# EAGLE design HW4 (EAGLE 9.6.2)
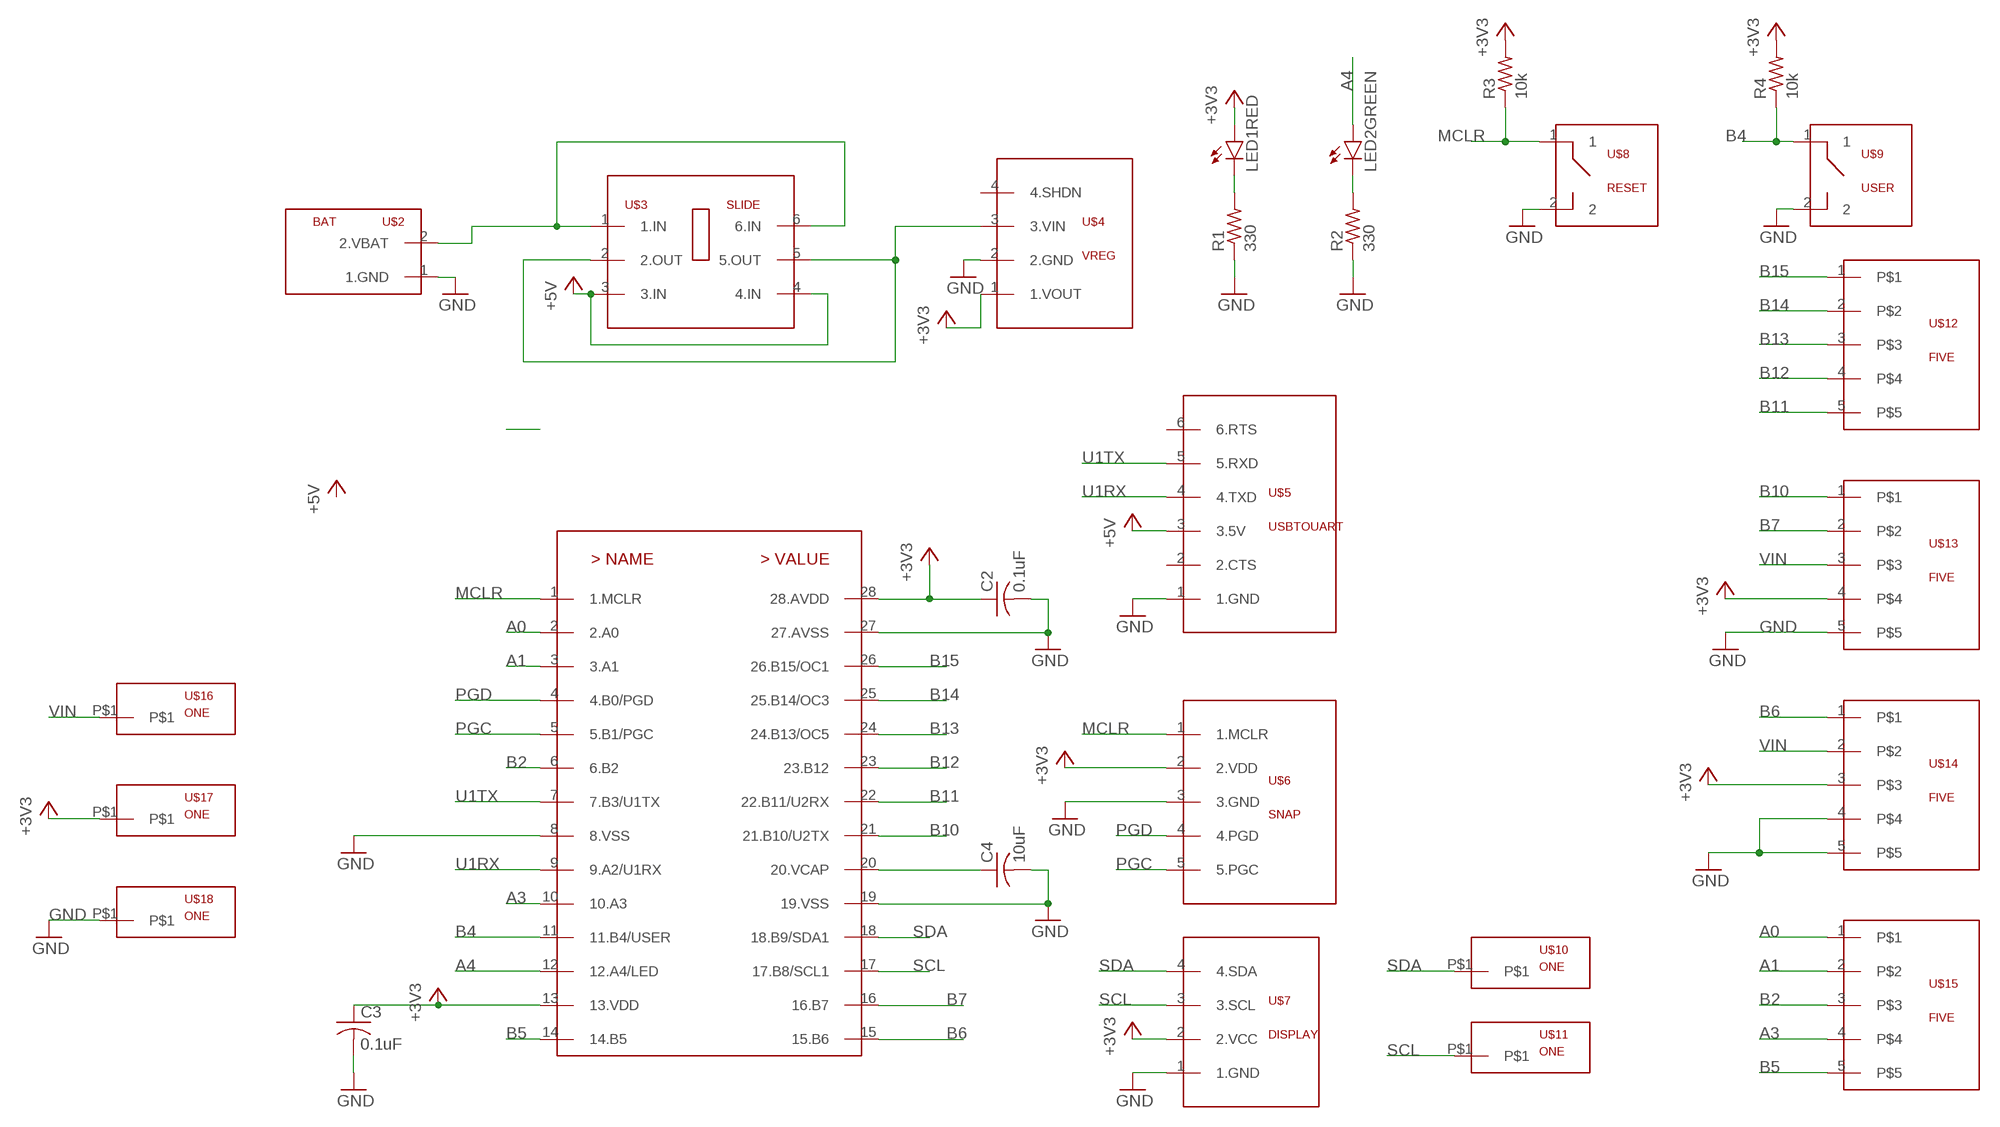
[diagram p0: schematic, sheet 1]

## Parts
C2  0.1uF  C-US025-024X044  [C025-024X044]
C3  0.1uF  C-US025-024X044  [C025-024X044]
C4  10uF  C-US025-024X044  [C025-024X044]
LED1RED  LED3MM  [LED3MM]
LED2GREEN  LED3MM  [LED3MM]
R1  330  R-US_0207/7  [0207/7]
R2  330  R-US_0207/7  [0207/7]
R3  10k  R-US_0207/7  [0207/7]
R4  10k  R-US_0207/7  [0207/7]
U$1  PIC32  [DIL28-3]
U$2  BAT  [BAT]
U$3  SLIDE  [SLIDE]
U$4  VREG  [VREG]
U$5  USBTOUART  [USBTOUART]
U$6  SNAP  [SNAP]
U$7  DISPLAY  [DISPLAY]
U$8  RESET  BUTTON  [BUTTON]
U$9  USER  BUTTON  [BUTTON]
U$10  ONE  [ONE]
U$11  ONE  [ONE]
U$12  FIVE  [FIVE]
U$13  FIVE  [FIVE]
U$14  FIVE  [FIVE]
U$15  FIVE  [FIVE]
U$16  ONE  [ONE]
U$17  ONE  [ONE]
U$18  ONE  [ONE]

## Nets
+3V3: C2.1 C3.1 LED1RED.A R3.2 R4.2 U$1.13(13.VDD) U$1.28(28.AVDD) U$4.1(1.VOUT) U$6.2(2.VDD) U$7.2(2.VCC) U$13.4 U$14.3 U$17.P$1
+5V: U$3.3(3.IN) U$3.4(4.IN) U$5.3(3.5V)
A0: U$1.2(2.A0) U$15.1
A1: U$1.3(3.A1) U$15.2
A3: U$1.10(10.A3) U$15.4
A4: LED2GREEN.A U$1.12(12.A4/LED)
B2: U$1.6(6.B2) U$15.3
B4: R4.1 U$1.11(11.B4/USER) U$9.1
B5: U$1.14(14.B5) U$15.5
B6: U$1.15(15.B6) U$14.1
B7: U$1.16(16.B7) U$13.2
B10: U$1.21(21.B10/U2TX) U$13.1
B11: U$1.22(22.B11/U2RX) U$12.5
B12: U$1.23(23.B12) U$12.4
B13: U$1.24(24.B13/OC5) U$12.3
B14: U$1.25(25.B14/OC3) U$12.2
B15: U$1.26(26.B15/OC1) U$12.1
GND: C2.2 C3.2 C4.2 R1.1 R2.1 U$1.8(8.VSS) U$1.19(19.VSS) U$1.27(27.AVSS) U$2.1(1.GND) U$4.2(2.GND) U$5.1(1.GND) U$6.3(3.GND) U$7.1(1.GND) U$8.2 U$9.2 U$13.5 U$14.4 U$14.5 U$18.P$1
MCLR: R3.1 U$1.1(1.MCLR) U$6.1(1.MCLR) U$8.1
N$1: LED1RED.K(C) R1.2
N$2: LED2GREEN.K(C) R2.2
N$3: U$2.2(2.VBAT) U$3.1(1.IN) U$3.6(6.IN)
N$4: U$3.2(2.OUT) U$3.5(5.OUT) U$4.3(3.VIN)
N$17: C4.1 U$1.20(20.VCAP)
PGC: U$1.5(5.B1/PGC) U$6.5(5.PGC)
PGD: U$1.4(4.B0/PGD) U$6.4(4.PGD)
SCL: U$1.17(17.B8/SCL1) U$7.3(3.SCL) U$11.P$1
SDA: U$1.18(18.B9/SDA1) U$7.4(4.SDA) U$10.P$1
U1RX: U$1.9(9.A2/U1RX) U$5.4(4.TXD)
U1TX: U$1.7(7.B3/U1TX) U$5.5(5.RXD)
VIN: U$13.3 U$14.2 U$16.P$1
Unconnected: U$4.4(4.SHDN) U$5.2(2.CTS) U$5.6(6.RTS)

## Library data of the parts
C2-C4 = hw4:C-US: CAPACITOR, American symbol; SPICEPREFIX: C
LED1RED LED2GREEN = hw4:LED: LED OSRAM: - CHIPLED LG R971, LG N971, LY N971, LG Q971, LY Q971, LO R971, LY R971 LH N974, LH R974 LS Q976, LO Q976, LY Q976 LO Q996 - Hyper CHIPLED LW Q18S LB Q993, LB Q99A, LB R99A - SideLED LS A670, LO A670, LY A670, LG A670, LP A670 LB A673, LV A673, LT A673, LW A673 LH A674 LY A675 LS A676, LA A676, LO A676, LY A676, LW A676 LS A679, LY A679, LG A679 - Hyper Micro SIDELED® LS Y876, LA Y876, LO Y876, LY Y876 LT Y87S - SmartLED LW L88C, LW L88S LB L89C, LB L89S, LG L890 LS L89K, LO L89K, LY L89K LS L896, LA L896, LO L896, LY L896 - TOPLED LS T670, LO T670, LY T670, LG T670, LP T670 LSG T670, LSP T670, LSY T670, LOP T670, LYG T670 LG T671, LOG T671, LSG T671 LB T673, LV T673, LT T673, LW T673 LH T674 LS T676, LA T676, LO T676, LY T676, LB T676, LH T676, LSB T676, LW T676 LB T67C, LV T67C, LT T67C, LS T67K, LO T67K, LY T67K, LW E67C LS E67B, LA E67B, LO E67B, LY E67B, LB E67C, LV E67C, LT E67C LW T67C LS T679, LY T679, LG T679 LS T770, LO T770, LY T770, LG T770, LP T770 LB T773, LV T773, LT T773, LW T773 LH T774 LS E675, LA E675, LY E675, LS T675 LS T776, LA T776, LO T776, LY T776, LB T776 LHGB T686 LT T68C, LB T68C - Hyper Mini TOPLED® LB M676 - Mini TOPLED Santana® LG M470 LS M47K, LO M47K, LY M47K Source: http://www.osram.convergy.de LUXEON: - LUMILED® LXK2-PW12-R00, LXK2-PW12-S00, LXK2-PW14-U00, LXK2-PW14-V00 LXK2-PM12-R00, LXK2-PM12-S00, LXK2-PM14-U00 LXK2-PE12-Q00, LXK2-PE12-R00, LXK2-PE12-S00, LXK2-PE14-T00, LXK2-PE14-U00 LXK2-PB12-K00, LXK2-PB12-L00, LXK2-PB12-M00, LXK2-PB14-N00, LXK2-PB14-P00, LXK2-PB14-Q00 LXK2-PR12-L00, LXK2-PR12-M00, LXK2-PR14-Q00, LXK2-PR14-R00 LXK2-PD12-Q00, LXK2-PD12-R00, LXK2-PD12-S00 LXK2-PH12-R00, LXK2-PH12-S00 LXK2-PL12-P00, LXK2-PL12-Q00, LXK2-PL12-R00 Source: www.luxeon.com KINGBRIGHT: KA-3528ASYC Source: www.kingbright.com
R1-R4 = hw4:R-US_: RESISTOR, American symbol; SPICEPREFIX: R
U$1 = hw4:PIC32
U$2 = hw4:BAT
U$3 = hw4:SLIDE
U$4 = hw4:VREG
U$5 = hw4:USBTOUART
U$6 = hw4:SNAP
U$7 = hw4:DISPLAY
U$8 U$9 = hw4:BUTTON
U$10 U$11 U$16-U$18 = hw4:ONE
U$12-U$15 = hw4:FIVE

## Board
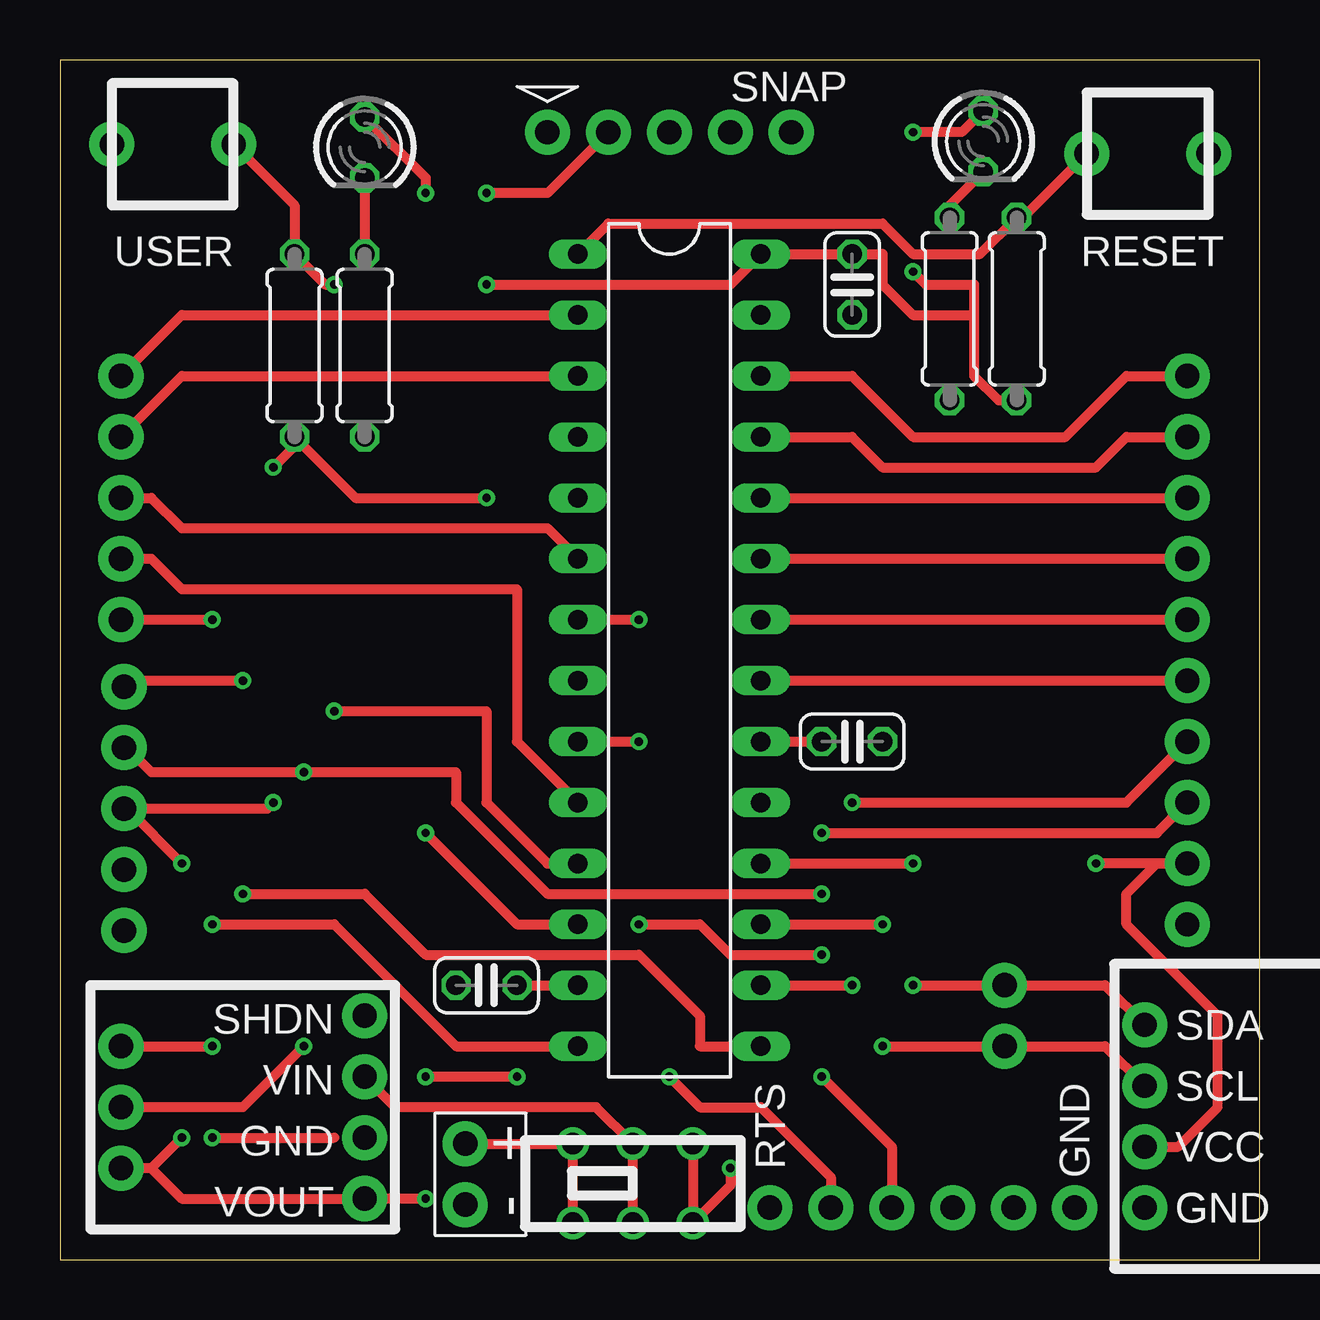
[diagram p1: board, top side]
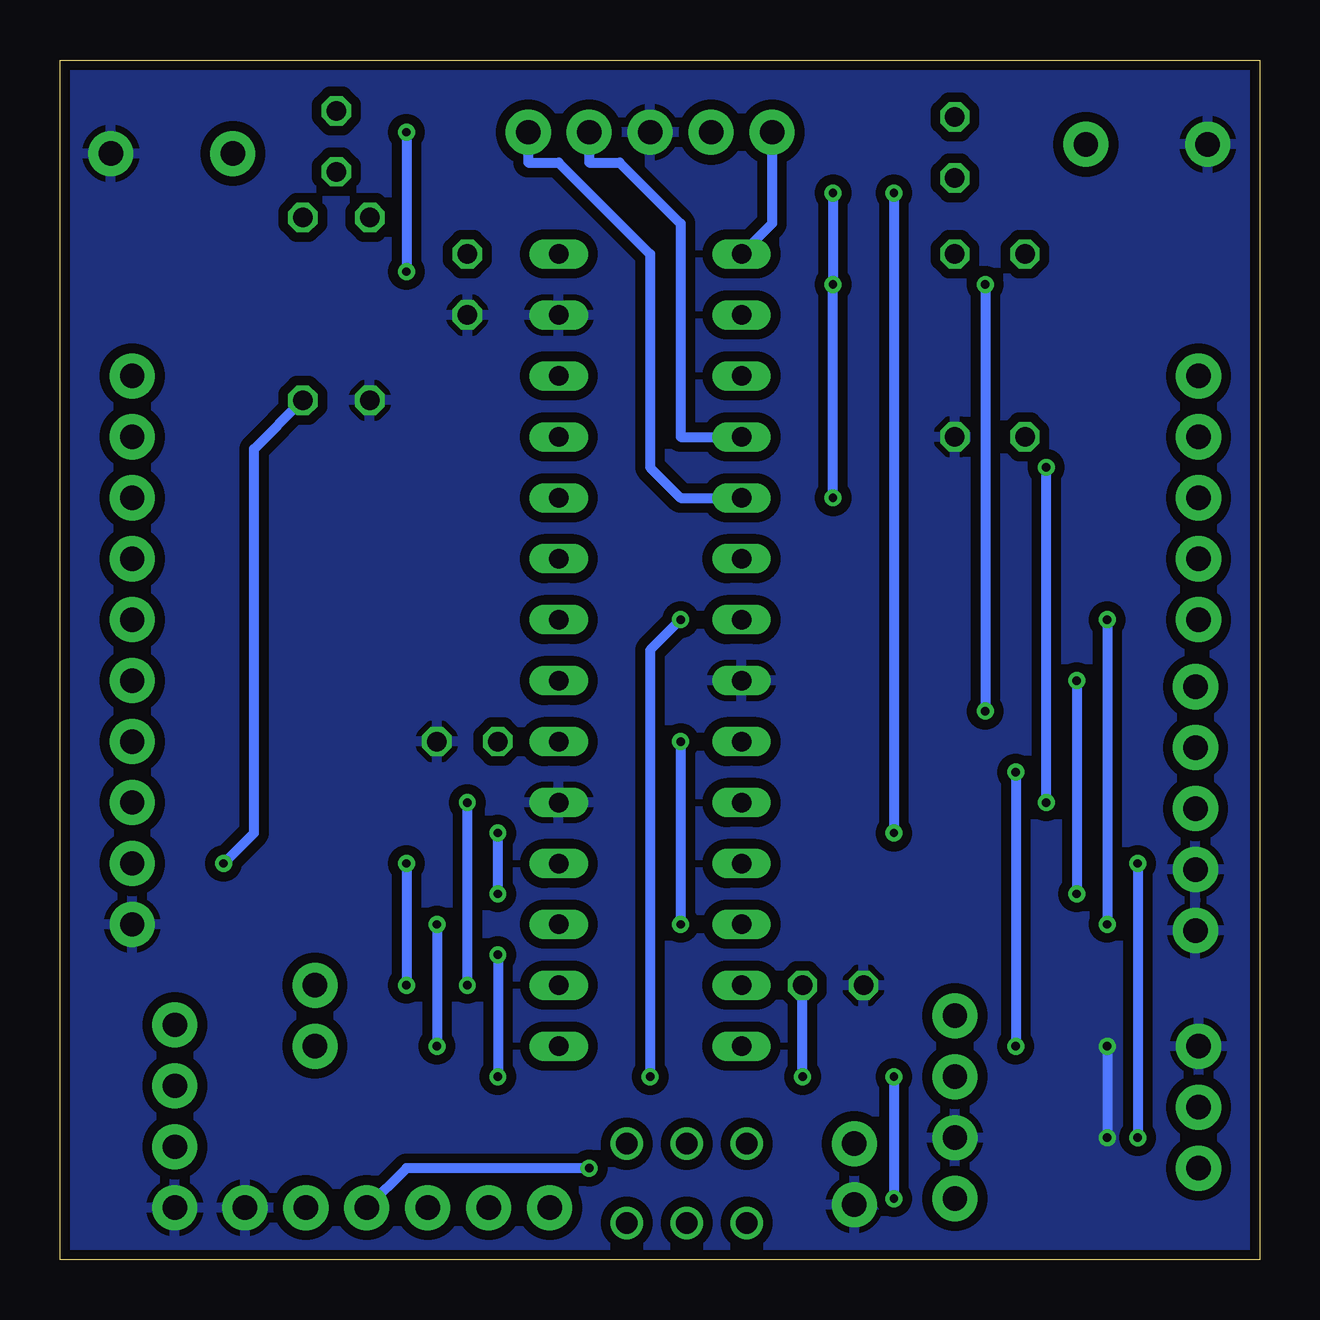
[diagram p2: board, bottom side, seen from below]

Size 50 x 50 mm. Coordinates in mm from the lower left corner, seen from the top.
Outline: 0,0 50,0 50,50 0,50 0,0
Copper layers (1*16): Top 0.035mm / dielectric 1.5mm / Bottom 0.035mm
Design rules "SparkFun-2-Layer-General-JLCPCB": minimum track width 7mil, minimum drill 0.3mm, track to track 7mil, track to pad 7mil, pad to pad 7mil, via to via 7mil, smd to smd 7mil, copper to edge 7mil, drill to drill 7mil, minimum pad ring 7mil, minimum via ring 7mil, stop-mask expansion 3mil, vias tented up to drill 25mil, thermal gap 10mil

### Footprints (pad centres in the part's own frame; a part is rotated, then mirrored left to right if it is on the bottom)
C025-024X044 = drill 0.813 octagon: 1 -1.27,0; 2 1.27,0
LED3MM = drill 0.813 octagon: A -1.27,0; K 1.27,0
0207/7 = drill 0.813 octagon: 1 -3.81,0; 2 3.81,0
DIL28-3 = drill 0.813 long: 1 -16.51,-3.81; 2 -13.97,-3.81; 3 -11.43,-3.81; 4 -8.89,-3.81; 5 -6.35,-3.81; 6 -3.81,-3.81; 7 -1.27,-3.81; 8 1.27,-3.81; 9 3.81,-3.81; 10 6.35,-3.81; 11 8.89,-3.81; 12 11.43,-3.81; 13 13.97,-3.81; 14 16.51,-3.81; 15 16.51,3.81; 16 13.97,3.81; 17 11.43,3.81; 18 8.89,3.81; 19 6.35,3.81; 20 3.81,3.81; 21 1.27,3.81; 22 -1.27,3.81; 23 -3.81,3.81; 24 -6.35,3.81; 25 -8.89,3.81; 26 -11.43,3.81; 27 -13.97,3.81; 28 -16.51,3.81
BAT = drill 1.016 pad 1.88: 1 -1.27,0; 2 1.27,0
SLIDE = drill 0.9: 1 -2.5,-1.65; 2 0,-1.65; 3 2.5,-1.65; 4 2.5,1.65; 5 0,1.65; 6 -2.5,1.65
VREG = drill 1.016 pad 1.88: 1 -3.81,0; 2 -1.27,0; 3 1.27,0; 4 3.81,0
USBTOUART = drill 1.016 pad 1.88: 1 -6.35,0; 2 -3.81,0; 3 -1.27,0; 4 1.27,0; 5 3.81,0; 6 6.35,0
SNAP = drill 1.016 pad 1.88: 1 -5.08,0; 2 -2.54,0; 3 0,0; 4 2.54,0; 5 5.08,0
DISPLAY = drill 1.016 pad 1.88: 1 -5.08,-3.81; 2 -5.08,-1.27; 3 -5.08,1.27; 4 -5.08,3.81
BUTTON = drill 1.016 pad 1.88: 1 -2.54,0; 2 2.54,0
ONE = drill 1.016 pad 1.88: P$1 0,0
FIVE = drill 1.016 pad 1.88: 1 -5.08,0; 2 -2.54,0; 3 0,0; 4 2.54,0; 5 5.08,0

### Placement (x,y rotation side)
C2  33.02,40.64 270 top
C3  17.78,11.43 180 top
C4  33.02,21.59 0 top
LED1RED  38.48,46.61 270 top
LED2GREEN  12.7,46.35 270 top
R1  37.08,39.62 90 top
R2  12.7,38.1 90 top
R3  39.88,39.62 270 top
R4  9.78,38.1 270 top
U$1  25.4,25.4 270 top
U$2  16.89,3.56 90 top
U$3  23.88,3.17 0 top
U$4  12.7,6.35 90 top
U$5  35.94,2.16 180 top
U$6  25.4,46.99 0 top
U$7  50.29,5.97 0 top
U$8  45.34,46.1 0 top
U$9  4.7,46.48 180 top
U$10  39.37,11.43 0 top
U$11  39.37,8.89 0 top
U$12  46.99,31.75 270 top
U$13  46.99,19.05 270 top
U$14  2.67,18.8 270 top
U$15  2.54,31.75 270 top
U$16  2.54,6.35 0 top
U$17  2.54,3.81 0 top
U$18  2.54,8.89 0 top

### Tracks (layer width: path | path; a pad name or v marks a point on that pad's centre or on a via)
+3V3  (via drill 0.35)
  Top 0.406: C3.1 U$1.13 | U$7.2 46.61,4.7 48.26,6.35 48.26,10.16 44.45,13.97 44.45,15.24 45.72,16.51 U$13.4 v43.18,16.51 | 3.81,3.81 5.08,2.54 U$4.1 v15.24,2.54 | v17.78,31.75 12.32,31.75 R4.2 9.78,33.91 v8.89,33.02 | v17.78,40.64 27.94,40.64 U$1.28 C2.1 34.29,41.91 34.29,40.64 35.56,39.37 38.1,39.37 | U$6.2 20.32,44.45 v17.78,44.45 | LED1RED.A 37.59,46.99 v35.56,46.99 | 38.1,39.37 38.1,36.83 39.12,35.81 R3.2 | v35.56,41.18 36.1,40.64 38.1,40.64 38.1,39.37 | v8.89,19.05 8.64,18.8 U$14.3 2.79,18.8 v5.08,16.51 | v5.08,5.08 3.81,3.81 | 3.81,3.81 U$17.P$1 | v19.05,7.62 v15.24,7.62
  Bottom 0.406: v43.18,16.51 41.91,17.78 41.91,33.78 R3.2 | v19.05,7.62 C3.1 | v17.78,31.75 v17.78,40.64 v17.78,44.45 | v35.56,46.99 v35.56,41.18 | v8.89,19.05 v8.89,33.02 | v5.08,16.51 v5.08,5.08 | v15.24,7.62 v15.24,2.54
+5V  (via drill 0.35)
  Top 0.406: U$3.4 U$3.3 27.94,3.09 v27.94,3.81
  Bottom 0.406: v27.94,3.81 35.56,3.81 U$5.3
A0
  Top 0.406: U$15.1 5.08,39.37 U$1.2
A1
  Top 0.406: U$15.2 5.08,36.83 U$1.3
A3
  Top 0.406: U$15.4 3.81,29.21 5.08,27.94 19.05,27.94 19.05,21.59 U$1.10
A4  (via drill 0.35)
  Top 0.406: LED2GREEN.A 15.24,45.09 v15.24,44.45 | v15.24,17.78 19.05,13.97 U$1.12
  Bottom 0.406: v15.24,44.45 v15.24,17.78
B2
  Top 0.406: U$15.3 3.81,31.75 5.08,30.48 20.32,30.48 U$1.6
B4  (via drill 0.35)
  Top 0.406: U$9.1 9.78,43.94 R4.1 11.05,40.64 v11.43,40.64 | U$1.11 20.32,16.51 17.78,19.05 17.78,22.86 v11.43,22.86
  Bottom 0.406: v11.43,40.64 v11.43,22.86
B5  (via drill 0.35)
  Top 0.406: U$1.14 16.51,8.89 11.43,13.97 v6.35,13.97 | U$15.5 v6.35,26.67
  Bottom 0.406: v6.35,26.67 v6.35,13.97
B6  (via drill 0.35)
  Top 0.406: U$14.1 2.92,24.13 v7.62,24.13 | U$1.15 26.67,8.89 26.67,10.16 24.13,12.7 15.24,12.7 12.7,15.24 v7.62,15.24
  Bottom 0.406: v7.62,24.13 v7.62,15.24
B7  (via drill 0.35)
  Top 0.406: U$1.16 v33.02,11.43 | U$13.2 44.45,19.05 v33.02,19.05
  Bottom 0.406: 33.02,17.78 v33.02,11.43 v33.02,19.05
B10
  Top 0.406: U$1.21 U$13.1
B11
  Top 0.406: U$1.22 U$12.5
B12
  Top 0.406: U$1.23 U$12.4
B13
  Top 0.406: U$1.24 U$12.3
B14
  Top 0.406: U$1.25 33.02,34.29 34.29,33.02 43.18,33.02 44.45,34.29 U$12.2
B15
  Top 0.406: U$1.26 33.02,36.83 35.56,34.29 41.91,34.29 44.45,36.83 U$12.1
GND  (via drill 0.35)
  Top 0.406: U$18.P$1 v6.35,8.89 | v6.35,5.08 11.43,5.08
  Bottom 0.406: v6.35,8.89 v6.35,5.08
  pour Bottom (isolate 0.406): 0,0 50.8,0 50.8,50.8 0,50.8
MCLR
  Top 0.406: U$8.1 40.13,43.43 R3.1 38.35,41.91 35.56,41.91 34.29,43.18 22.86,43.18 U$1.1
  Bottom 0.406: U$1.1 20.32,43.18 U$6.1
N$1
  Top 0.406: LED1RED.K 37.08,43.94 R1.2
N$2
  Top 0.406: LED2GREEN.K R2.2
N$3
  Top 0.406: U$3.1 U$3.6 U$2.2
N$4
  Top 0.406: U$3.2 U$3.5 22.35,6.35 13.97,6.35 U$4.3
N$17
  Top 0.406: U$1.20 C4.1
PGC
  Bottom 0.406: U$1.5 24.13,31.75 25.4,33.02 25.4,41.91 29.21,45.72 30.48,45.72 U$6.5
PGD
  Bottom 0.406: U$1.4 24.13,34.29 24.13,43.18 26.67,45.72 27.94,45.72 U$6.4
SCL  (via drill 0.35)
  Top 0.406: U$1.17 v34.29,13.97 | v34.29,8.89 U$11.P$1 43.56,8.89 U$7.3
  Bottom 0.406: v34.29,13.97 v34.29,8.89
SDA  (via drill 0.35)
  Top 0.406: U$1.18 v35.56,16.51 | v35.56,11.43 U$10.P$1 43.56,11.43 U$7.4
  Bottom 0.406: v35.56,16.51 v35.56,11.43
U1RX  (via drill 0.35)
  Top 0.406: U$1.9 v24.13,21.59 | v24.13,13.97 26.67,13.97 27.94,12.7 v31.75,12.7 | v31.75,7.62 34.67,4.7 U$5.4
  Bottom 0.406: v24.13,21.59 v24.13,13.97 | v31.75,12.7 v31.75,7.62
U1TX  (via drill 0.35)
  Top 0.406: U$1.7 v24.13,26.67 | v25.4,7.62 26.67,6.35 29.21,6.35 32.13,3.43 U$5.5
  Bottom 0.406: v24.13,26.67 25.4,25.4 v25.4,7.62
VIN  (via drill 0.35)
  Top 0.406: U$14.2 2.79,21.34 3.81,20.32 v10.16,20.32 16.51,20.32 16.51,19.05 20.32,15.24 v31.75,15.24 | v10.16,8.89 7.62,6.35 U$16.P$1 | v31.75,17.78 45.72,17.78 U$13.3
  Bottom 0.406: v10.16,20.32 v10.16,8.89 | v31.75,15.24 v31.75,17.78